# Altium project Calimotion 7.0.PrjPcb
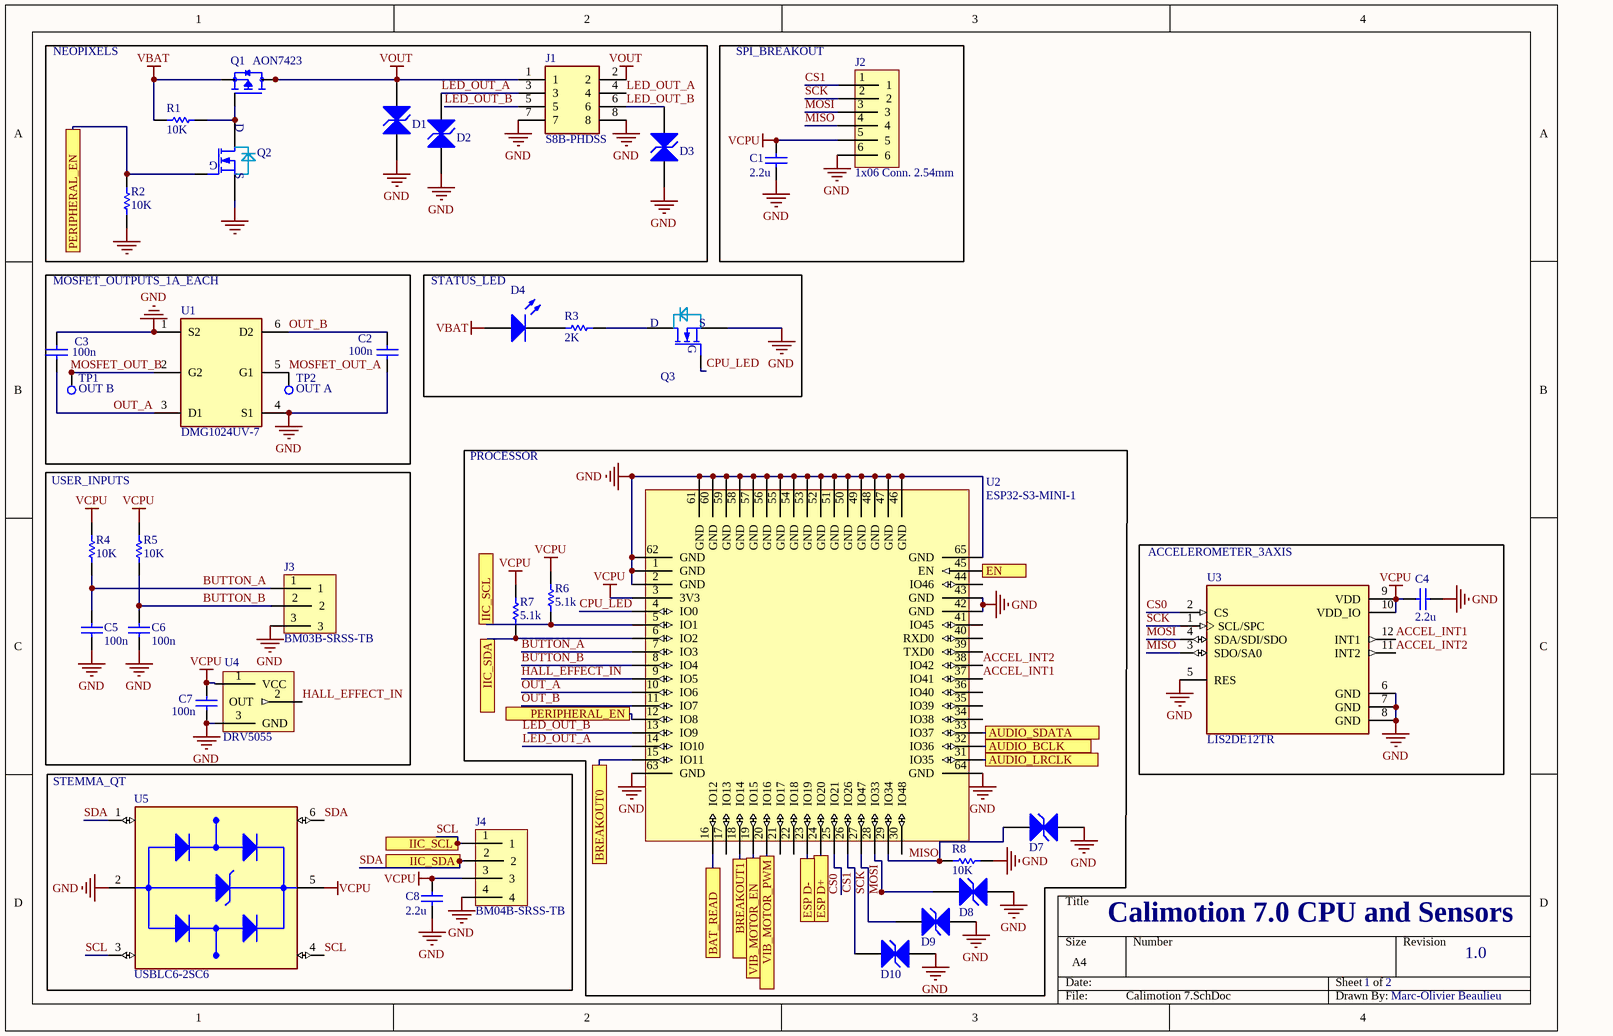
[diagram p0: Calimotion 7.SchDoc]
2 sheets, 71 parts. Net scope: flat (ports and power ports of the same name join across sheets).
Board file: Calimotion7_PCB.PcbDoc
Sheets:
  Calimotion 7.SchDoc
  Power_Delivery.SchDoc

## Sheet Calimotion 7.SchDoc: Calimotion 7.0
size A4; Date: 2024-06-17; Author: Marc-Olivier Beaulieu; CompanyName: Calimacil Inc.; DrawnBy: Marc-Olivier Beaulieu; Engineer: Marc-Olivier Beaulieu; Organization: Calimotion; Revision: 1.0; SheetNumber: 1; SheetTotal: 2; Time: 15:30

### Parts
C1  value 2.2u  [CAP 0402_1005]  (hidden comment: Capacitor)
C2  value 100n  [CAP 0402_1005]  (hidden comment: Capacitor)
C3  value 100n  [CAP 0402_1005]  (hidden comment: Capacitor)
C4  value 2.2u  [CAP 0402_1005]  (hidden comment: Capacitor)
C5  value 100n  [CAP 0402_1005]  (hidden comment: Capacitor)
C6  value 100n  [CAP 0402_1005]  (hidden comment: Capacitor)
C7  value 100n  [CAP 0402_1005]  (hidden comment: Capacitor)
C8  value 2.2u  [CAP 0402_1005]  (hidden comment: Capacitor)
D1  TVS  [SOD-923]  (value not drawn)
D2  TVS  [SOD-923]  (value not drawn)
D3  TVS  [SOD-923]  (value not drawn)
D4  Light-Emitting Diode  [LEDSC160X80X70L45N]  (value not drawn)
D7  TVS  [SOD-923]  (value not drawn)
D8  TVS  [SOD-923]  (value not drawn)
D9  TVS  [SOD-923]  (value not drawn)
D10  TVS  [SOD-923]  (value not drawn)
J1  S8B-PHDSS  [JST_S8B-PHDSS]
J2  1x06 Conn. 2.54mm  [1x06 Conn. 2.54mm]
J3  BM03B-SRSS-TB  [BM03B-SRSS-TB]
J4  BM04B-SRSS-TB  [BM04B-SRSS-TB]
Q1  AON7423  [TRANS_8PDFN]
Q2  MOSFET-N  [TRANS_SOT-416]  (value not drawn)
Q3  MOSFET-N  [TRANS_SOT-416]  (value not drawn)
R1  value 10K  [RES 0402_1005 RF]  (hidden comment: Resistor)
R2  value 10K  [RES 0402_1005 RF]  (hidden comment: Resistor)
R3  value 2K  [RES 0402_1005 RF]  (hidden comment: Resistor)
R4  value 10K  [RES 0402_1005 RF]  (hidden comment: Resistor)
R5  value 10K  [RES 0402_1005 RF]  (hidden comment: Resistor)
R6  value 5.1k  [RES 0402_1005 RF]  (hidden comment: Resistor)
R7  value 5.1k  [RES 0402_1005 RF]  (hidden comment: Resistor)
R8  value 10K  [RES 0402_1005 RF]  (hidden comment: Resistor)
TP1  OUT B  [THT-Test_Point]
TP2  OUT A  [THT-Test_Point]
U1  DMG1024UV-7  [74LVC2G17GW,125]
U2  ESP32-S3-MINI-1  [ESP32-S3-MINI-1]
U3  LIS2DE12TR  [LIS2DE12TR_200X200X100-12N]
U4  DRV5055  [SOT23-3]
U5  USBLC6-2SC6  [SOT95P280X145-6N]

### Blocks framed on the sheet
NEOPIXELS: D1-D3 J1 Q1 Q2 R1 R2
SPI_BREAKOUT: C1 J2
MOSFET_OUTPUTS_1A_EACH: C2 C3 TP1 TP2 U1
STATUS_LED: D4 Q3 R3
PROCESSOR: D7-D10 R6-R8 U2
USER_INPUTS: C5-C7 J3 R4 R5 U4
ACCELEROMETER_3AXIS: C4 U3
STEMMA_QT: C8 J4 U5

### Ports
AUDIO_BCLK (see Power_Delivery[1C]), AUDIO_LRCLK (see Power_Delivery[1C]), AUDIO_SDATA (see Power_Delivery[1C]), BAT_READ (see Power_Delivery[3A]), BREAKOUT0 (see Power_Delivery[1C]), BREAKOUT1 (see Power_Delivery[1C]), EN (see Power_Delivery[2B]), ESP D+ (see Power_Delivery[3C]), ESP D- (see Power_Delivery[3B]), IIC_SCL (see Calimotion 7[1D]), IIC_SCL (see Calimotion 7[2C]), IIC_SDA (see Calimotion 7[1D]), IIC_SDA (see Calimotion 7[2C]), PERIPHERAL_EN (see Calimotion 7[1A], Power_Delivery[1C]), PERIPHERAL_EN (see Calimotion 7[2C], Power_Delivery[1C]), VIB_MOTOR_EN (see Power_Delivery[1C]), VIB_MOTOR_PWM (see Power_Delivery[1C])

### Nets
GND: C1.1 C2.1 C3.2 C4.1 C5.2 C6.2 C7.1 C8.1 D1.A D2.A D3.A D7.A D8.A D9.A D10.A J1.7 J1.8 J2.6 J3.3 J4.4 Q2.S Q3.S R2.2 R8.1 U1.1(S2) U1.4(S1) U2.1(GND) U2.2(GND) U2.42(GND) U2.43(GND) U2.46(GND) U2.47(GND) U2.48(GND) U2.49(GND) U2.50(GND) U2.51(GND) U2.52(GND) U2.53(GND) U2.54(GND) U2.55(GND) U2.56(GND) U2.57(GND) U2.58(GND) U2.59(GND) U2.60(GND) U2.61(GND) U2.62(GND) U2.63(GND) U2.64(GND) U2.65(GND) U3.5(RES) U3.6(GND) U3.7(GND) U3.8(GND) U4.3(GND) U5.2(GND)
VBAT: D4.1(A) Q1.5_8(D) R1.2
VCPU: C1.2 C4.2 C7.2 C8.2 J2.5 J4.3 R4.1 R5.1 R6.2 R7.2 U2.3(3V3) U3.9(VDD) U3.10(VDD_IO) U4.1(VCC) U5.5(VBUS)
VOUT: D1.K J1.1 J1.2 Q1.1(S) Q1.2(S) Q1.3(S)
ACCEL_INT1: U2.37(IO41) U3.12(INT1)
ACCEL_INT2: U2.38(IO42) U3.11(INT2)
BUTTON_A: C5.1 J3.1 R4.2 U2.7(IO3)
BUTTON_B: C6.1 J3.2 R5.2 U2.8(IO4)
CPU_LED: Q3.G U2.4(IO0)
CS0: U2.25(IO21) U3.2(CS)
CS1: D10.K J2.1 U2.26(IO26)
ESP_D+: U2.24(IO20) ; port ESP D+
ESP_D-: U2.23(IO19) ; port ESP D-
HALL_EFFECT_IN: U2.9(IO5) U4.2(OUT)
LED_OUT_A: D2.K J1.3 J1.4 U2.14(IO10)
LED_OUT_B: D3.K J1.5 J1.6
MISO: D7.K J2.4 R8.2 U2.29(IO34) U3.3(SDO/SA0)
MOSFET_OUT_A: TP2.1(TP) U1.5(G1)
MOSFET_OUT_B: TP1.1(TP) U1.2(G2)
MOSI: D8.K J2.3 U2.28(IO33) U3.4(SDA/SDI/SDO)
OUT_A: C3.1 U1.3(D1) U2.10(IO6)
OUT_B: C2.2 U1.6(D2) U2.11(IO7)
SCK: D9.K J2.2 U2.27(IO47) U3.1(SCL/SPC)
SCL: J4.1 R6.1 U2.5(IO1) U5.3(I/O2_IN) U5.4(I/O2_OUT) ; port IIC_SCL
SDA: J4.2 R7.1 U2.6(IO2) U5.1(I/O1_IN) U5.6(I/O1_OUT) ; port IIC_SDA
NetC13_1: U2.16(IO12) ; port BAT_READ
NetC14_2: U2.45(EN) ; port EN
NetD4_2: D4.2(K) R3.2
NetJ6_1: U2.19(IO15) ; port VIB_MOTOR_EN
NetJ6_2: U2.20(IO16) ; port VIB_MOTOR_PWM
NetJ6_3: U2.15(IO11) ; port BREAKOUT0
NetJ6_4: U2.18(IO14) ; port BREAKOUT1
NetJ6_5: Q2.G R2.1 U2.12(IO8) ; port PERIPHERAL_EN
NetJ6_6: U2.33(IO37) ; port AUDIO_SDATA
NetJ6_7: U2.31(IO35) ; port AUDIO_LRCLK
NetJ6_8: U2.32(IO36) ; port AUDIO_BCLK
NetQ1_4: Q1.4(G) Q2.D R1.1
NetQ3_D: Q3.D R3.1

Not connected (* = marked no-connect by the designer): U2 13(IO9) 17(IO13) 21(IO17) 22(IO18) 30(IO48) 34(IO38) 35(IO39) 36(IO40) 39(TXD0) 40(RXD0) 41(IO45) 44(IO46)

### Notes on the sheet
- Calimotion 7.0 CPU and Sensors
- 1
- 2
- 1.0
- Marc-Olivier Beaulieu
- Labels drawn without touching a wire or pin: LED_OUT_B

### Library data of the parts
C1-C8 = Capacitor: SimulationGenericComponent: True
D1-D3 D7-D10 = DIO_1027: TVS 5.8V 50W SOD523; Manufacturer: On Semiconductor; Part_number: ESD5B5.0ST1G; P_Id: 27; Prod_Id: 1045; Bin: 2161 -- CT 198; FB_PCB_Number: DIO_1027; Footprint: SOD523_DIODE; Voltage: 5.8V; Curr: 50W; Price: 0.04790; Quantity: 0
D4 = LED: AF: 1; BV: 0; BV_MAX: 1e99; EG: 1.11; FC: 0.5; IBV: 0.001; IS: 1e-14; MJSW: 0.33; NTUN: 30; TNOM: 27; XTI: 3; SimulationGenericComponent: True; CJO: 0; CJP: 0; CTA: 0; CTP: 0; FCS: 0.5; FV_MAX: 1e99; IKF: 0; IKR: 0; ISR: 1e-14; JSW: 0; JTUN: 0; JTUNSW: 0; KEG: 1; KF: 0; LEVEL: 1; N: 1; NBV: 1; NR: 1; NS: 1; PHP: 1; RS: 0; TCV: 0; TLEV: 0; TLEVC: 0; TM1: 0; TM2: 0; TPB: 0; TPHP: 0; TRS: 0; TRS2: 0; TT: 0; TTT1: 0; TTT2: 0; VJ: 1; XTITUN: 3
J1 = S8B-PHDSS: Connector Header Through Hole, Right Angle 8 position 0.079 _2.00mm_; MF: JST Sales; SnapEDA_Link: https://www.snapeda.com/parts/S8B-PHDSS/JST%20Sales%20America%20Inc./view-part/761599/?ref=snap; Value: *; Price: None; Availability: Unavailable; MP: S8B-PHDSS; Package: None
J3 = BM03B-SRSS-TB: Connector Header Surface Mount 3 position 0.039" (1.00mm)
J4 = BM04B-SRSS-TB: Connector Header Surface Mount 4 position 0.039" (1.00mm)
Q1 = TSM085P03CV_RGG: -30, -64, Single P-Channel; MF: Taiwan Semiconductor Corporation; MP: TSM085P03CV RGG; SnapEDA_Link: https://www.snapeda.com/parts/TSM085P03CV%20RGG/Taiwan+Semiconductor/view-part/?ref=snap; Package: PDFN33 Taiwan Semiconductor; Value: *; Check_prices: https://www.snapeda.com/parts/TSM085P03CV%20RGG/Taiwan+Semiconductor/view-part/?ref=eda
Q2 = TRANS_1070: 20 V, 238 mA, Single, N−Channel, Gate ESD Protection, SC−75; Manufacturer: OnSemi; Part_number: NTA4001NT1G; Voltage: 20V; Pwr: 300mW; Curr: 238mA; Footprint: SC-75; Price: .01
Q3 = TRANS_1057: MOSFET N-CH 20V 915MA SOT-416; Manufacturer: ON Semiconductor; Part_number: NTA4153NT1G; Pwr: 300mW; FB_PCB_Number: TRANS_1057; Footprint: SOT-23-3-MOSFET; Voltage: 20V; Curr: 915mA; Price: NA; Quantity: 0
R1-R8 = Resistor: TC1: 0; SimulationGenericComponent: True; TC2: 0
TP1 TP2 = Test Point
U1 = DMG1024UV-7: Mosfet Array 2 N-Channel _Dual_ 20V 1.38A 530mW Surface Mount SOT-563; MF: Diodes Inc.; SnapEDA_Link: https://www.snapeda.com/parts/DMG1024UV-7/Diodes%20Inc./view-part/391731/?ref=snap; Price: None; Value: *; MP: DMG1024UV-7; Package: SOT-563 Diodes Inc.; Availability: Unavailable
U2 = ESP32-S3-MINI-1: Bluetooth, WiFi 802.11b/g/n, Bluetooth v5.0 Transceiver Module 2.4GHz PCB Trace Surface Mount
U3 = LIS2DE12TR: Accelerometer X, Y, Z Axis Â±2g, 4g, 8g, 16g 0.5Hz ~ 2.69kHz 12-LGA _2x2_; MF: STMicroelectronics; Package: LGA-12 STMicroelectronics; SnapEDA_Link: https://www.snapeda.com/parts/LIS2DE12TR/STMicroelectronics/view-part/470072/?ref=snap; MP: LIS2DE12TR; Value: *; Availability: Unavailable; Price: None
U4 = DRV5055: Hall Effect Sensor Single Axis SOT-23-3
U5 = USBLC6-2SC6: 17V Clamp 5A (8/20Âµs) Ipp Tvs Diode Surface Mount SOT-23-6; MF: STMicroelectronics; Value: *; SnapEDA_Link: https://www.snapeda.com/parts/USBLC6-2SC6/STMicroelectronics/view-part/?ref=snap; Check_prices: https://www.snapeda.com/parts/USBLC6-2SC6/STMicroelectronics/view-part/?ref=eda; Purchase-URL: https://pricing.snapeda.com/search/part/USBLC6-2SC6/?ref=eda; Price: None; Availability: In Stock; Package: SOT-23-6 STMicroelectronics; MP: USBLC6-2SC6

## Sheet Power_Delivery.SchDoc: Calimotion 7.0
size A4; Date: 2024-06-17; Author: Marc-Olivier Beaulieu; CompanyName: Calimacil Inc.; DrawnBy: Marc-Olivier Beaulieu; Engineer: Marc-Olivier Beaulieu; Organization: Calimotion; Revision: 1.0; SheetNumber: 2; SheetTotal: 2; Time: 15:30
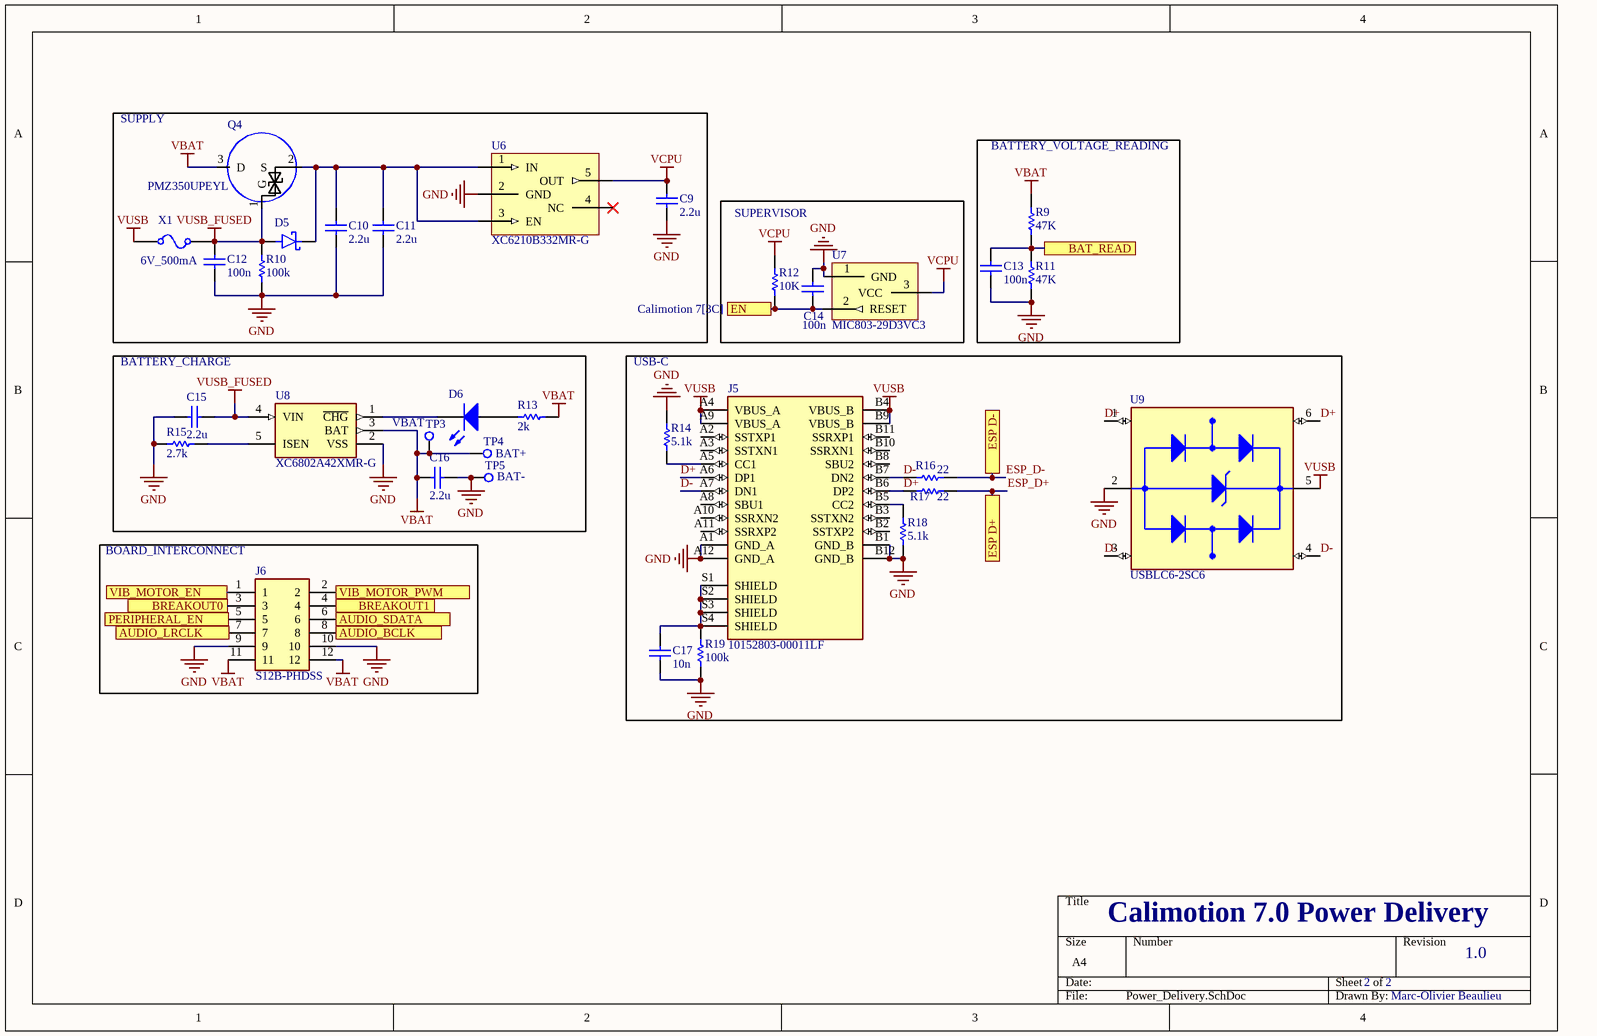
[diagram p1: Power_Delivery.SchDoc]

### Parts
C9  value 2.2u  [CAP 0402_1005]  (hidden comment: Capacitor)
C10  value 2.2u  [CAP 0402_1005]  (hidden comment: Capacitor)
C11  value 2.2u  [CAP 0402_1005]  (hidden comment: Capacitor)
C12  value 100n  [CAP 0402_1005]  (hidden comment: Capacitor)
C13  value 100n  [CAP 0402_1005]  (hidden comment: Capacitor)
C14  value 100n  [CAP 0402_1005]  (hidden comment: Capacitor)
C15  value 2.2u  [CAP 0402_1005]  (hidden comment: Capacitor)
C16  value 2.2u  [CAP 0402_1005]  (hidden comment: Capacitor)
C17  value 10n  [CAP 0402_1005]  (hidden comment: Capacitor)
D5  SHOTTKY  [SOD-923]  (value not drawn)
D6  Light-Emitting Diode  [LEDSC160X80X70L45N]  (value not drawn)
J5  10152803-00011LF  [AMPHENOL_10152803-00011LF]
J6  S12B-PHDSS  [JST_S12B-PHDSS]
Q4  PMZ350UPEYL  [SOT-883]
R9  value 47K  [RES 0402_1005 RF]  (hidden comment: Resistor)
R10  value 100k  [RES 0402_1005 RF]  (hidden comment: Resistor)
R11  value 47K  [RES 0402_1005 RF]  (hidden comment: Resistor)
R12  value 10K  [RES 0402_1005 RF]  (hidden comment: Resistor)
R13  value 2k  [RES 0402_1005 RF]  (hidden comment: Resistor)
R14  value 5.1k  [RES 0402_1005 RF]  (hidden comment: Resistor)
R15  value 2.7k  [RES 0402_1005 RF]  (hidden comment: Resistor)
R16  value 22  [RES 0402_1005 RF]  (hidden comment: Resistor)
R17  value 22  [RES 0402_1005 RF]  (hidden comment: Resistor)
R18  value 5.1k  [RES 0402_1005 RF]  (hidden comment: Resistor)
R19  value 100k  [RES 0402_1005 RF]  (hidden comment: Resistor)
TP3  VBAT  [THT-Test_Point]
TP4  BAT+  [THT-Test_Point]
TP5  BAT-  [THT-Test_Point]
U6  XC6210B332MR-G  [SOT-25]
U7  MIC803-29D3VC3  [MIC803-29D3VC3]
U8  XC6802A42XMR-G  [SOT-25]
U9  USBLC6-2SC6  [SOT95P280X145-6N]
X1  CURRENT: 6V_500mA  [RES 0402_1005 RF]  (hidden comment: Fuse)

### Blocks framed on the sheet
SUPPLY: C9-C12 D5 Q4 R10 U6 X1
BATTERY_VOLTAGE_READING: C13 R9 R11
SUPERVISOR: C14 R12 U7
BATTERY_CHARGE: C15 C16 D6 R13 R15 TP3-TP5 U8
USB-C: C17 J5 R14 R16-R19 U9
BOARD_INTERCONNECT: J6

### Ports
AUDIO_BCLK (see Calimotion 7[3C]), AUDIO_LRCLK (see Calimotion 7[3C]), AUDIO_SDATA (see Calimotion 7[3C]), BAT_READ (see Calimotion 7[2D]), BREAKOUT0 (see Calimotion 7[2D]), BREAKOUT1 (see Calimotion 7[2D]), EN (see Calimotion 7[3C]), ESP D+ (see Calimotion 7[3D]), ESP D- (see Calimotion 7[3D]), PERIPHERAL_EN (see Calimotion 7[1A], Calimotion 7[2C]), VIB_MOTOR_EN (see Calimotion 7[2D]), VIB_MOTOR_PWM (see Calimotion 7[2D])

### Nets
GND: C9.1 C10.2 C11.2 C12.1 C13.2 C14.1 C15.2 C16.1 C17.2 J5.A1(GND_A) J5.A12(GND_A) J5.B1(GND_B) J5.B12(GND_B) J6.9 J6.10 R10.2 R11.2 R14.2 R15.2 R18.1 R19.2 TP5.1(TP) U6.2(GND) U7.1(GND) U8.2(VSS) U9.2(GND)
VBAT: C16.2 J6.11 J6.12 Q4.3(D) R9.1 R13.1 TP3.1(TP) TP4.1(TP) U8.3(BAT)
VCPU: C9.2 R12.2 U6.5(OUT) U7.3(VCC)
VUSB: J5.A4(VBUS_A) J5.A9(VBUS_A) J5.B4(VBUS_B) J5.B9(VBUS_B) U9.5(VBUS) X1.1
VUSB_FUSED: C12.2 C15.1 D5.A Q4.1(G) R10.1 U8.4(VIN) X1.2
D+: J5.A6(DP1) J5.B6(DP2) R17.1 U9.1(I/O1_IN) U9.6(I/O1_OUT)
D-: J5.A7(DN1) J5.B7(DN2) R16.1 U9.3(I/O2_IN) U9.4(I/O2_OUT)
ESP_D+: R17.2 ; port ESP D+
ESP_D-: R16.2 ; port ESP D-
NetC10_1: C10.1 C11.1 D5.C(K) Q4.2(S) U6.1(IN) U6.3(EN)
NetC13_1: C13.1 R9.2 R11.1 ; port BAT_READ
NetC14_2: C14.2 R12.1 U7.2(RESET) ; port EN
NetC17_1: C17.1 J5.S1(SHIELD) J5.S2(SHIELD) J5.S3(SHIELD) J5.S4(SHIELD) R19.1
NetD6_1: D6.1(A) R13.2
NetD6_2: D6.2(K) U8.1(~{CHG})
NetJ5_A5: J5.A5(CC1) R14.1
NetJ5_B5: J5.B5(CC2) R18.2
NetJ6_1: J6.1 ; port VIB_MOTOR_EN
NetJ6_2: J6.2 ; port VIB_MOTOR_PWM
NetJ6_3: J6.3 ; port BREAKOUT0
NetJ6_4: J6.4 ; port BREAKOUT1
NetJ6_5: J6.5 ; port PERIPHERAL_EN
NetJ6_6: J6.6 ; port AUDIO_SDATA
NetJ6_7: J6.7 ; port AUDIO_LRCLK
NetJ6_8: J6.8 ; port AUDIO_BCLK
NetR15_1: R15.1 U8.5(ISEN)

Not connected (* = marked no-connect by the designer): J5 A2(SSTXP1) A3(SSTXN1) A8(SBU1) A10(SSRXN2) A11(SSRXP2) B2(SSTXP2) B3(SSTXN2) B8(SBU2) B10(SSRXN1) B11(SSRXP1); U6 4(NC)*

### Notes on the sheet
- Calimotion 7.0 Power Delivery
- 2
- 1.0
- Marc-Olivier Beaulieu

### Library data of the parts
C9-C17 = Capacitor: SimulationGenericComponent: True
D5 = SHOTTKY: Generic Shottky; MF: ON Semiconductor; MP: ESD9X5.0ST5G; Availability: Unavailable; Value: *; Package: SOD-923 ON Semiconductor; Price: None; SnapEDA_Link: https://www.snapeda.com/parts/ESD9X5.0ST5G/ON%20Semiconductor/view-part/237761/?ref=snap
D6 = LED: as D4 on sheet Calimotion 7; CJO: 0; CJP: 0; CTA: 0; CTP: 0; FCS: 0.5; FV_MAX: 1e99; IKF: 0; IKR: 0; ISR: 1e-14; JSW: 0; JTUN: 0; JTUNSW: 0; KEG: 1; KF: 0; LEVEL: 1; N: 1; NBV: 1; NR: 1; NS: 1; PHP: 1; RS: 0; TCV: 0; TLEV: 0; TLEVC: 0; TM1: 0; TM2: 0; TPB: 0; TPHP: 0; TRS: 0; TRS2: 0; TT: 0; TTT1: 0; TTT2: 0; VJ: 1; XTITUN: 3
J5 = 10152803-00011LF: USB 3.2 Type C GEN 2 Receptacle SMT Dual Row 24in; MF: Amphenol FCI; Package: None; Price: None; Check_prices: https://www.snapeda.com/parts/10152803-00011LF/Amphenol/view-part/?ref=eda; Value: *; SnapEDA_Link: https://www.snapeda.com/parts/10152803-00011LF/Amphenol/view-part/?ref=snap; MP: 10152803-00011LF; Availability: In Stock; Purchase-URL: https://pricing.snapeda.com/search?q=10152803-00011LF&ref=eda
J6 = S12B-PHDSS: Connector Header Through Hole, Right Angle 12 position 0.079 _2.00mm_; MF: JST Sales; MP: S8B-PHDSS; SnapEDA_Link: https://www.snapeda.com/parts/S8B-PHDSS/JST%20Sales%20America%20Inc./view-part/761599/?ref=snap; Value: *; Price: None; Availability: Unavailable; Package: None
Q4 = PMZ350UPEYL: P-Channel 20 V 1A (Ta) 360mW (Ta), 3.125W (Tc) Surface Mount SOT-883
R9-R19 = Resistor: TC1: 0; SimulationGenericComponent: True; TC2: 0
TP3-TP5 = Test Point
U6 = XC6210B332MR-G: Linear Voltage Regulator IC Positive Fixed 1 Output 700mA SOT-25
U7 = MIC803-29D3VC3: Supervisor Open Drain or Open Collector 1 Channel SC-70-3 Voltage - Threshold 2.93V
U8 = XC6802A42XMR-G: Charger IC Lithium Ion/Polymer SOT-25; MF: Torex; Package: SOT-753 Torex; MP: XC6802A42XMR-G; Value: *; Availability: Unavailable; SnapEDA_Link: https://www.snapeda.com/parts/XC6802A42XMR-G/Torex/view-part/378965/?ref=snap; Price: None
U9 = USBLC6-2SC6: as U5 on sheet Calimotion 7; Value: *; SnapEDA_Link: https://www.snapeda.com/parts/USBLC6-2SC6/STMicroelectronics/view-part/?ref=snap; Check_prices: https://www.snapeda.com/parts/USBLC6-2SC6/STMicroelectronics/view-part/?ref=eda; Purchase-URL: https://pricing.snapeda.com/search/part/USBLC6-2SC6/?ref=eda; Price: None; Availability: In Stock; Package: SOT-23-6 STMicroelectronics; MP: USBLC6-2SC6
X1 = Fuse: RESISTANCE: 1m; SimulationGenericComponent: True

## Nets that join several sheets
GND: Calimotion 7 (56 pins), Power_Delivery (26 pins)
VBAT: Calimotion 7 (D4.1 Q1.5_8 R1.2), Power_Delivery (9 pins)
VCPU: Calimotion 7 (15 pins), Power_Delivery (C9.2 R12.2 U6.5 U7.3)
ESP_D+: Calimotion 7 (U2.24), Power_Delivery (R17.2)
ESP_D-: Calimotion 7 (U2.23), Power_Delivery (R16.2)
NetC13_1: Calimotion 7 (U2.16), Power_Delivery (C13.1 R9.2 R11.1)
NetC14_2: Calimotion 7 (U2.45), Power_Delivery (C14.2 R12.1 U7.2)
NetJ6_1: Calimotion 7 (U2.19), Power_Delivery (J6.1)
NetJ6_2: Calimotion 7 (U2.20), Power_Delivery (J6.2)
NetJ6_3: Calimotion 7 (U2.15), Power_Delivery (J6.3)
NetJ6_4: Calimotion 7 (U2.18), Power_Delivery (J6.4)
NetJ6_5: Calimotion 7 (Q2.G R2.1 U2.12), Power_Delivery (J6.5)
NetJ6_6: Calimotion 7 (U2.33), Power_Delivery (J6.6)
NetJ6_7: Calimotion 7 (U2.31), Power_Delivery (J6.7)
NetJ6_8: Calimotion 7 (U2.32), Power_Delivery (J6.8)